# Altium schematic sheet POWER.SchDoc
size A4
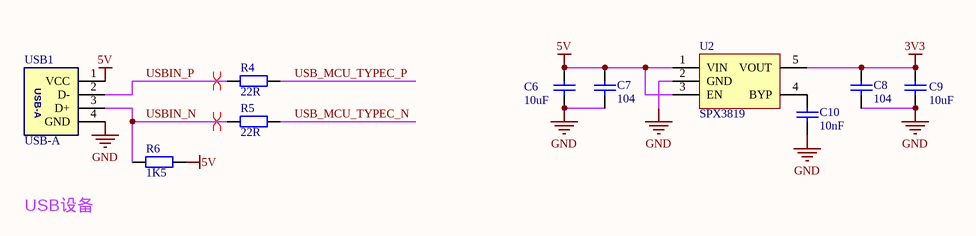
[diagram p0: POWER.SchDoc]

## Parts
C6  10uF  [Cap-0603-M]
C7  104  [Cap-0402-M]
C8  104  [Cap-0402-M]
C9  10uF  [Cap-0603-M]
C10  10nF  [Cap-0402-M]
R4  22R  [Res-0402-M]
R5  22R  [Res-0402-M]
R6  1K5  [Res-0402-M]
U2  SPX3819  [SOT23-5]
USB1  USB-A  [USB_A/P_B]

## Nets
3V3: C8.2 C9.2 U2.5(VOUT)
5V: C6.2 C7.2 R6.2 U2.1(VIN) U2.3(EN) USB1.1(VCC)
GND: C6.1 C7.1 C8.1 C9.1 C10.1 U2.2(GND) USB1.4(GND)
USB_MCU_TYPEC_N: R5.2
USB_MCU_TYPEC_P: R4.2
USBIN_N: R5.1 R6.1 USB1.3(D+)
USBIN_P: R4.1 USB1.2(D-)
NetC10_2: C10.2 U2.4(BYP)

## Layout directives
differential pair: USBIN_N, USBIN_P

## Notes on the sheet
- USB设备

## Library data of the parts
C6-C10 = CAP: 贴片陶瓷电容
R4-R6 = RES: 贴片电阻